# EAGLE design fat_pannal (EAGLE 6.1)
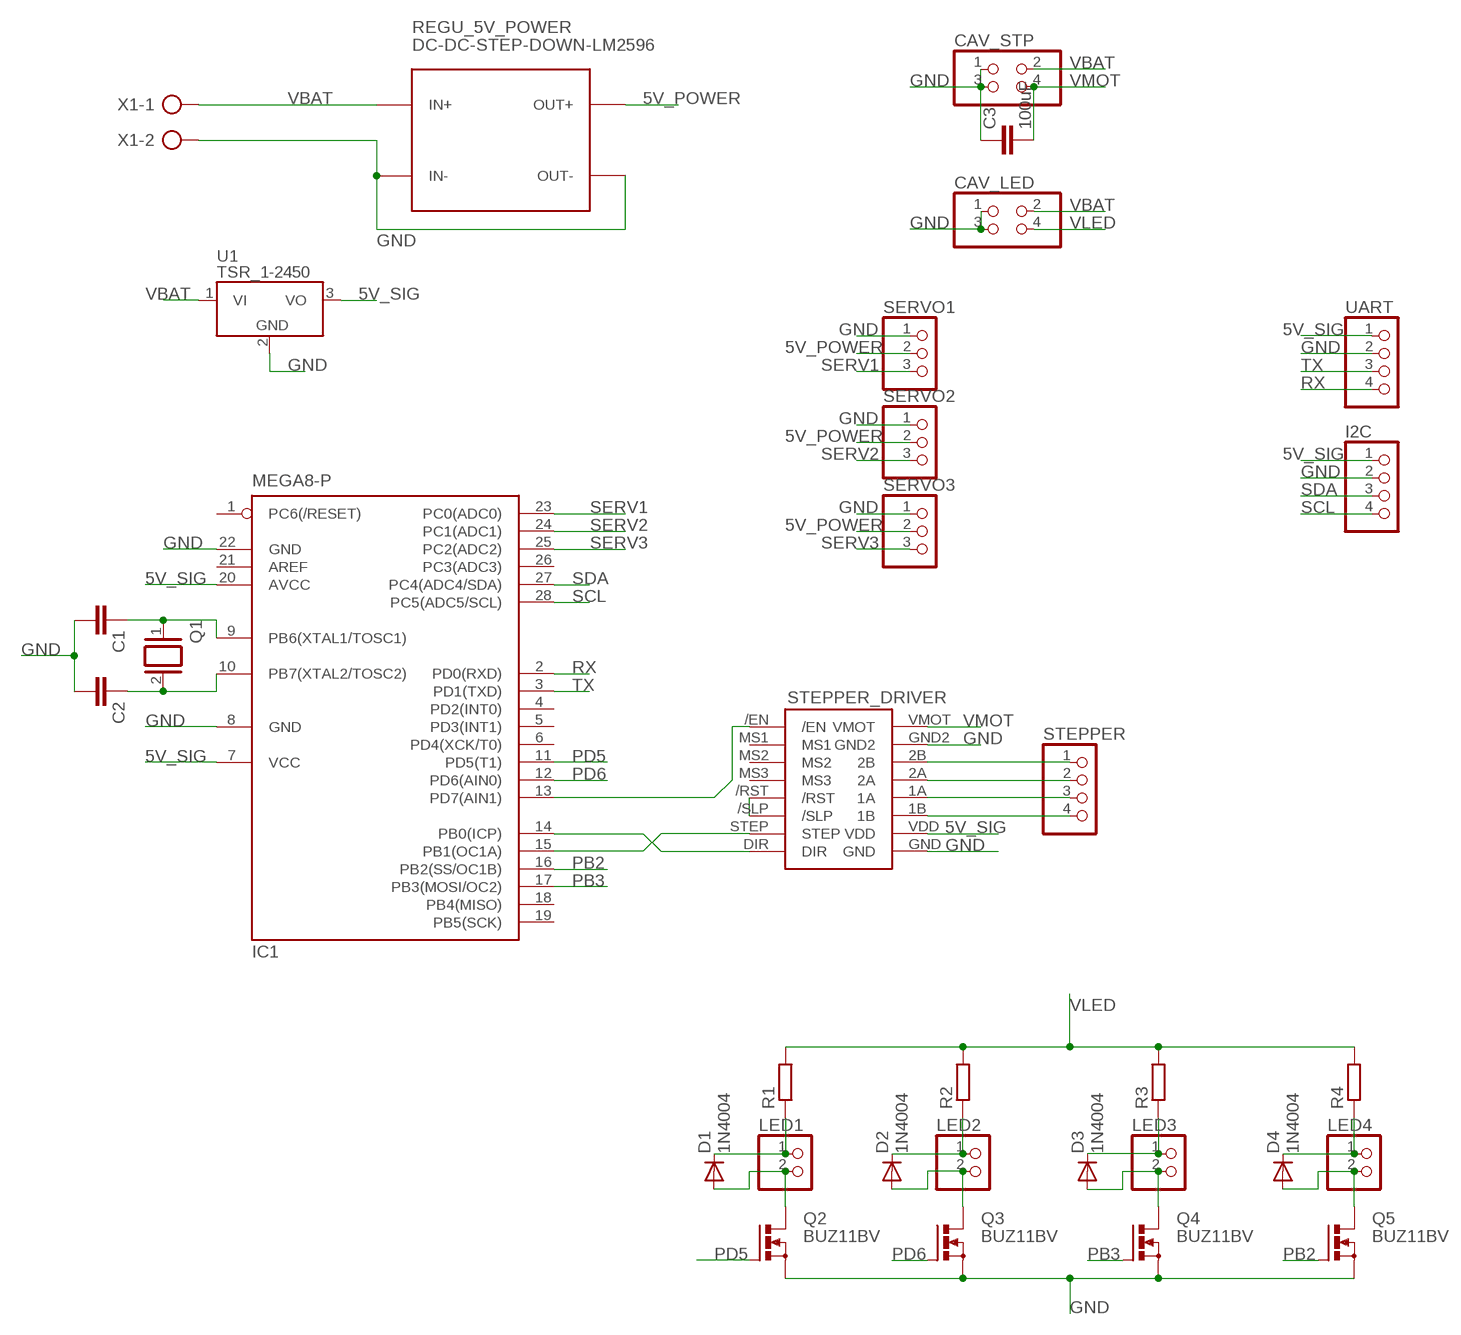
[diagram p0: schematic, sheet 1]

## Parts
C1  C-EU025-030X050  [C025-030X050]
C2  C-EU025-030X050  [C025-030X050]
C3  100uF  C-EU025-050X050  [C025-050X050]
CAV_LED  PINHD-2X2  [2X02]
CAV_STP  PINHD-2X2  [2X02]
D1  1N4004  [DO41-10]
D2  1N4004  [DO41-10]
D3  1N4004  [DO41-10]
D4  1N4004  [DO41-10]
I2C  PINHD-1X4  [1X04]
IC1  MEGA8-P  [DIL28-3]
LED1  PINHD-1X2  [1X02]
LED2  PINHD-1X2  [1X02]
LED3  PINHD-1X2  [1X02]
LED4  PINHD-1X2  [1X02]
Q1  XTAL/S  [QS]
Q2  BUZ11BV  [TO220BV]
Q3  BUZ11BV  [TO220BV]
Q4  BUZ11BV  [TO220BV]
Q5  BUZ11BV  [TO220BV]
R1  R-EU_0309/12  [0309/12]
R2  R-EU_0309/12  [0309/12]
R3  R-EU_0309/12  [0309/12]
R4  R-EU_0309/12  [0309/12]
REGU_5V_POWER  DC-DC-STEP-DOWN-LM2596  [DC-DC-STEP-DOWN-LM2596]
SERVO1  PINHD-1X3  [1X03]
SERVO2  PINHD-1X3  [1X03]
SERVO3  PINHD-1X3  [1X03]
STEPPER  PINHD-1X4  [1X04]
STEPPER_DRIVER  A4988_CARRIER  [A4988_CARRIER]
U1  TSR_1-2450  [TSR-1]
UART  PINHD-1X4  [1X04]
X1  AK300/2  [AK300/2]

## Nets
5V_POWER: REGU_5V_POWER.OUT+ SERVO1.2 SERVO2.2 SERVO3.2
5V_SIG: I2C.1 IC1.7(VCC) IC1.20(AVCC) STEPPER_DRIVER.VDD U1.3(VO) UART.1
GND: C1.2 C2.2 C3.1 CAV_LED.1 CAV_LED.3 CAV_STP.1 CAV_STP.3 I2C.2 IC1.8(GND) IC1.22(GND) Q2.S Q3.S Q4.S Q5.S REGU_5V_POWER.IN- REGU_5V_POWER.OUT- SERVO1.1 SERVO2.1 SERVO3.1 STEPPER_DRIVER.GND STEPPER_DRIVER.GND2 U1.2(GND) UART.2 X1.2
N$1: C1.1 IC1.9(PB6(XTAL1/TOSC1)) Q1.1
N$2: IC1.15(PB1(OC1A)) STEPPER_DRIVER.STEP
N$3: C2.1 IC1.10(PB7(XTAL2/TOSC2)) Q1.2
N$6: IC1.14(PB0(ICP)) STEPPER_DRIVER.DIR
N$9: STEPPER_DRIVER./RST STEPPER_DRIVER./SLP
N$10: IC1.13(PD7(AIN1)) STEPPER_DRIVER./EN
N$11: STEPPER.4 STEPPER_DRIVER.1B
N$12: STEPPER.3 STEPPER_DRIVER.1A
N$13: STEPPER.2 STEPPER_DRIVER.2A
N$14: STEPPER.1 STEPPER_DRIVER.2B
N$19: D1.C LED1.1 R1.1
N$20: D2.C LED2.1 R2.1
N$23: D3.C LED3.1 R3.1
N$24: D4.C LED4.1 R4.1
N$26: D1.A LED1.2 Q2.D
N$27: D2.A LED2.2 Q3.D
N$28: D3.A LED3.2 Q4.D
N$29: D4.A LED4.2 Q5.D
PB2: IC1.16(PB2(SS/OC1B)) Q5.G
PB3: IC1.17(PB3(MOSI/OC2)) Q4.G
PD5: IC1.11(PD5(T1)) Q2.G
PD6: IC1.12(PD6(AIN0)) Q3.G
RX: IC1.2(PD0(RXD)) UART.4
SCL: I2C.4 IC1.28(PC5(ADC5/SCL))
SDA: I2C.3 IC1.27(PC4(ADC4/SDA))
SERV1: IC1.23(PC0(ADC0)) SERVO1.3
SERV2: IC1.24(PC1(ADC1)) SERVO2.3
SERV3: IC1.25(PC2(ADC2)) SERVO3.3
TX: IC1.3(PD1(TXD)) UART.3
VBAT: CAV_LED.2 CAV_STP.2 REGU_5V_POWER.IN+ U1.1(VI) X1.1
VLED: CAV_LED.4 R1.2 R2.2 R3.2 R4.2
VMOT: C3.2 CAV_STP.4 STEPPER_DRIVER.VMOT
Unconnected: IC1.1(PC6(/RESET)) IC1.4(PD2(INT0)) IC1.5(PD3(INT1)) IC1.6(PD4(XCK/T0)) IC1.18(PB4(MISO)) IC1.19(PB5(SCK)) IC1.21(AREF) IC1.26(PC3(ADC3)) STEPPER_DRIVER.MS1 STEPPER_DRIVER.MS2 STEPPER_DRIVER.MS3

## Library data of the parts
C1-C3 = rcl:C-EU: CAPACITOR, European symbol
CAV_LED CAV_STP = pinhead:PINHD-2X2: PIN HEADER
D1-D4 = diode:1N4004: DIODE general purpose rectifier, 1 A
I2C STEPPER UART = pinhead:PINHD-1X4: PIN HEADER
IC1 = atmel:MEGA8-P: MICROCONTROLLER 8 Kbytes FLASH, 1 kbytes SRAM, 512 bytes EEPROM, USART, 4-channel 10 bit ADC, 2-channel 8 bit ADC Pin compatible with Atmega48, ATMega88, ATMega168 Source: avr.lbr; OC_FARNELL: unknown; OC_NEWARK: unknown
LED1-LED4 = pinhead:PINHD-1X2: PIN HEADER
Q1 = special:XTAL/S: CRYSTAL
Q2-Q5 = transistor-power:BUZ11: N-CHANNEL MOS FET
R1-R4 = rcl:R-EU_: RESISTOR, European symbol
REGU_5V_POWER = diy-modules:DC-DC-STEP-DOWN-LM2596: DC/DC Step-Down Regulator based on LM2596-ADJ chip LM2596 datasheet available here: http://www.ti.com/lit/ds/symlink/lm2596.pdf Click here to find device on ebay.com <http://www.ebay.com/sch/lm2596+power+regulator>
SERVO1-SERVO3 = pinhead:PINHD-1X3: PIN HEADER
STEPPER_DRIVER = pololu_stepper_driver:A4988_CARRIER
U1 = _traco_tsr-1:TSR_1-*: TRACO TSR-1 Series Point-of-Load DC/DC-Converters Vi max. 36 V; Vo = (1.2 .. 15)V ±2%; Io = 0 .. 1 A SIP-Package (drop-in replacement for 78xx linear voltage regulators in TO220-package, vertically assembled) Source: www.tracopower.com Technologies: TSR 1- Vi (V) Vo (V) ±2% Io = 0 .. 1 A 24_ ( generic ) 2412 4.6 .. 36 1.2 2415 4.6 .. 36 1.5 2418 4.6 .. 36 1.8 2425 4.6 .. 36 2.5 2433 4.75.. 36 3.3 2450 6.5 .. 36 5.0 2465 9.0 .. 36 6.5 2490 12 .. 36 9.0 24120 15 .. 36 12 24150 18 .. 36 15 Author: Dipl.-Ing. FH Rainer Bayer HHN Hochschule Heilbronn, rainer.bayer@hs-heilbronn.de Ingenieurbüro ing-rb, mail@ing-rb.de
X1 = con-ptr500:AK300/2: CONNECTOR; OC_FARNELL: unknown; OC_NEWARK: unknown

## Board
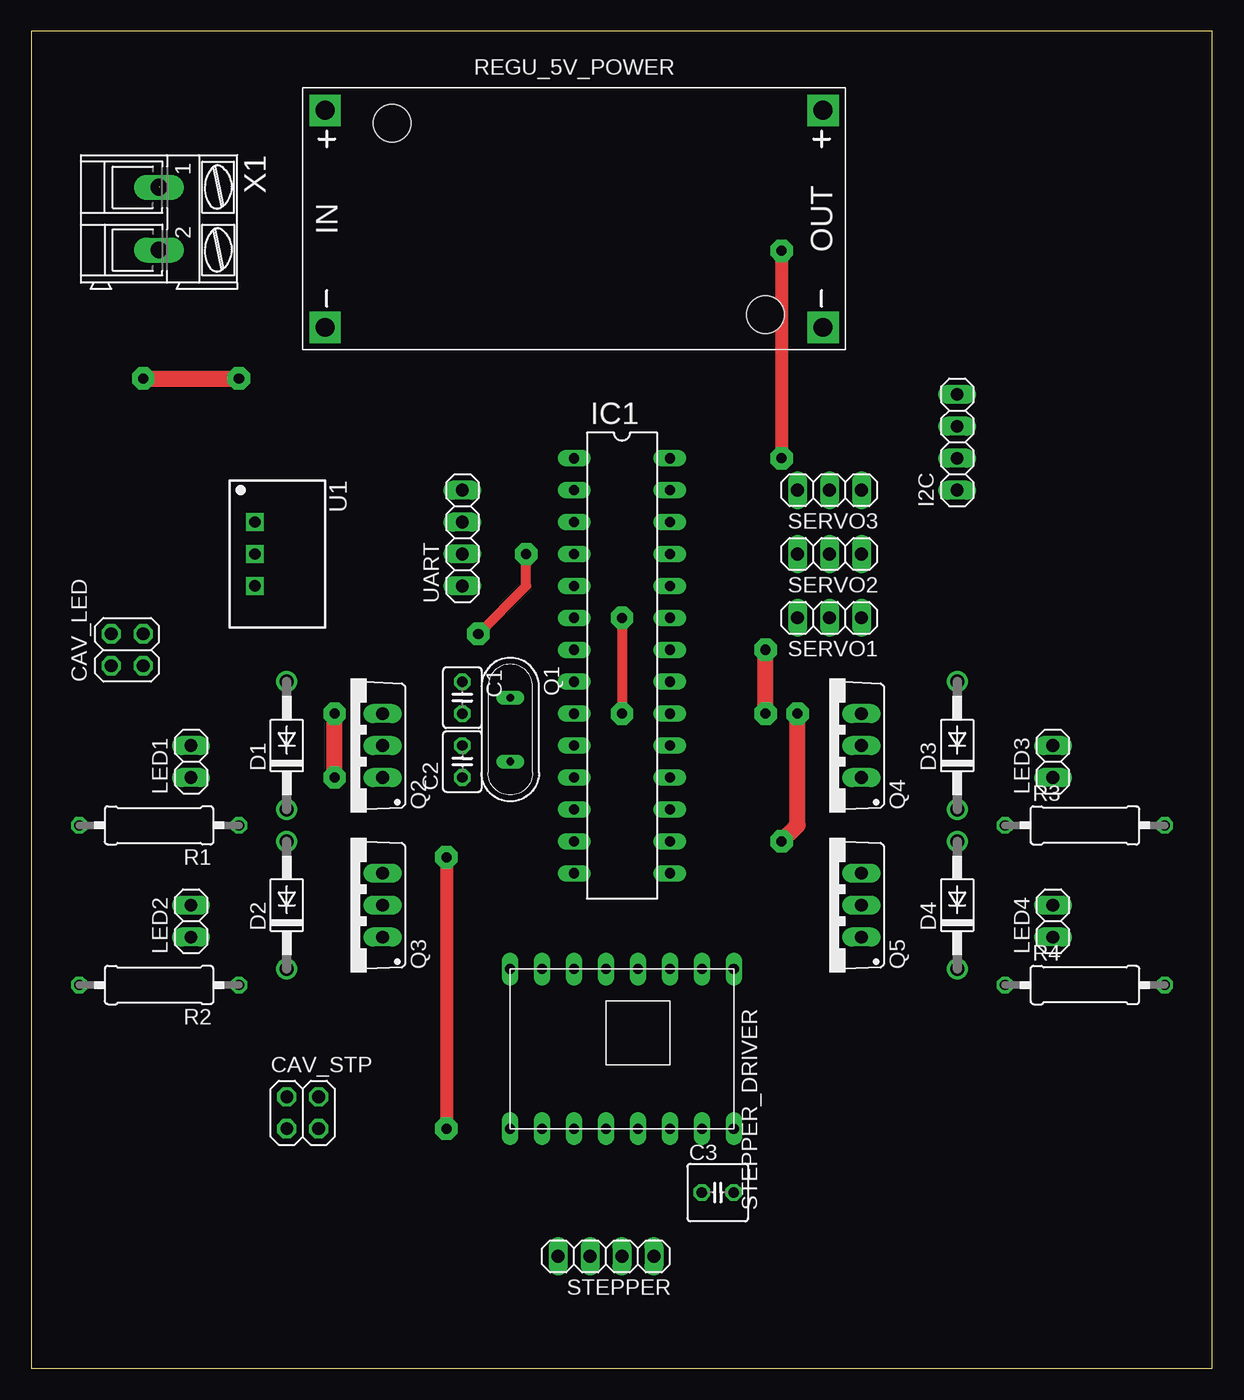
[diagram p1: board, top side]
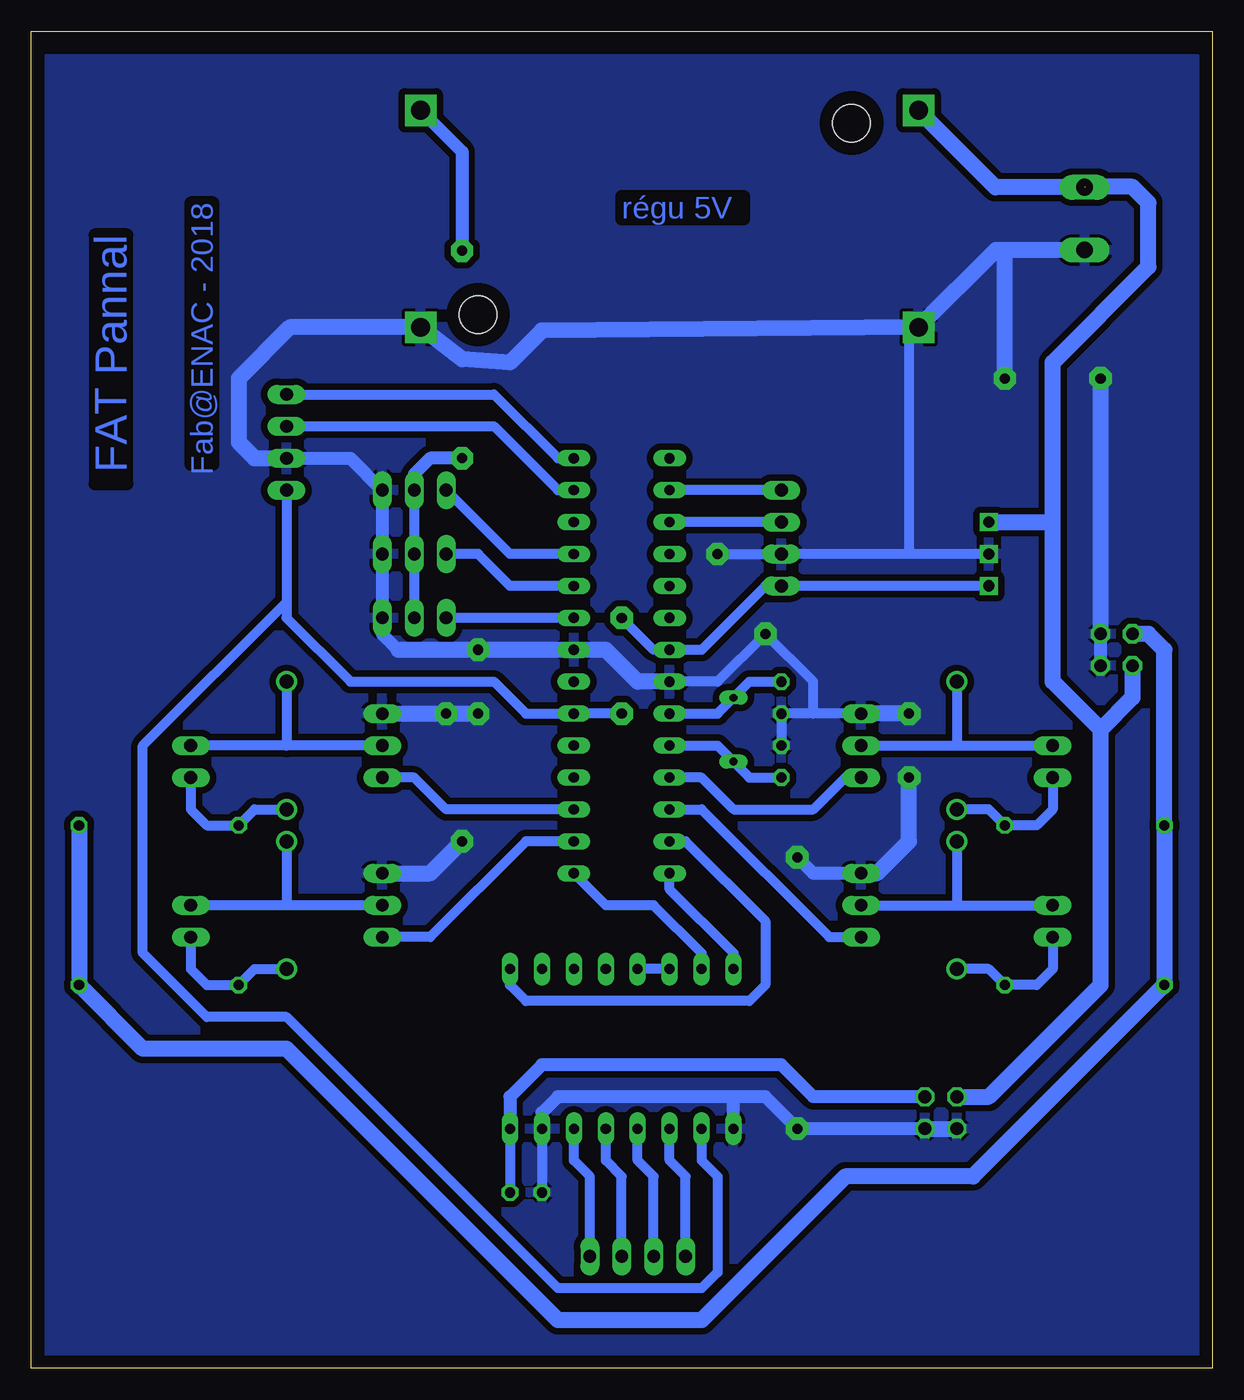
[diagram p2: board, bottom side, seen from below]

Size 93.96 x 106.35 mm. Coordinates in mm from the lower left corner, seen from the top.
Outline: 0,0 93.96,0 93.96,106.35 0,106.35 0,0
Copper layers (1*16): Top 0.035mm / dielectric 1.5mm / Bottom 0.035mm
Design rules: minimum track width 10mil, minimum drill 24mil, track to track 20mil, track to pad 20mil, pad to pad 8mil, via to via 8mil, smd to smd 8mil, copper to edge 40mil, drill to drill 8mil, minimum pad ring 10mil, minimum via ring 8mil, stop-mask expansion 4mil, vias tented up to drill 0mil, thermal gap 10mil

### Footprints (pad centres in the part's own frame; a part is rotated, then mirrored left to right if it is on the bottom)
C025-030X050 = drill 0.813 octagon: 1 -1.27,0; 2 1.27,0
C025-050X050 = drill 0.813 octagon: 1 -1.27,0; 2 1.27,0
2X02 = drill 1.016 octagon: 1 -1.27,-1.27; 2 -1.27,1.27; 3 1.27,-1.27; 4 1.27,1.27
DO41-10 = drill 1.118: A 5.08,0; C -5.08,0
1X04 = drill 1.016 long: 1 -3.81,0; 2 -1.27,0; 3 1.27,0; 4 3.81,0
DIL28-3 = drill 0.813 long: 1 -16.51,-3.81; 2 -13.97,-3.81; 3 -11.43,-3.81; 4 -8.89,-3.81; 5 -6.35,-3.81; 6 -3.81,-3.81; 7 -1.27,-3.81; 8 1.27,-3.81; 9 3.81,-3.81; 10 6.35,-3.81; 11 8.89,-3.81; 12 11.43,-3.81; 13 13.97,-3.81; 14 16.51,-3.81; 15 16.51,3.81; 16 13.97,3.81; 17 11.43,3.81; 18 8.89,3.81; 19 6.35,3.81; 20 3.81,3.81; 21 1.27,3.81; 22 -1.27,3.81; 23 -3.81,3.81; 24 -6.35,3.81; 25 -8.89,3.81; 26 -11.43,3.81; 27 -13.97,3.81; 28 -16.51,3.81
1X02 = drill 1.016 long: 1 -1.27,0; 2 1.27,0
QS = drill 0.61 long: 1 -2.54,0; 2 2.54,0
TO220BV = drill 1.016 long: D 0,-2.54; G -2.54,-2.54; S 2.54,-2.54
0309/12 = drill 0.813 octagon: 1 -6.35,0; 2 6.35,0
DC-DC-STEP-DOWN-LM2596 = drill 1.5 pad 2.5 square: IN+ -19.812,8.636; IN- -19.812,-8.636; OUT+ 19.812,8.636; OUT- 19.812,-8.636 | hole 3: -14.478,7.62; 15.24,-7.62
1X03 = drill 1.016 long: 1 -2.54,0; 2 0,0; 3 2.54,0
A4988_CARRIER = drill 0.8 long: 1A 5.08,-2.54; 1B 5.08,-5.08; 2A 5.08,0; 2B 5.08,2.54; /EN -7.62,7.62; /RST -7.62,-2.54; /SLP -7.62,-5.08; DIR -7.62,-10.16; GND 5.08,-10.16; GND2 5.08,5.08; MS1 -7.62,5.08; MS2 -7.62,2.54; MS3 -7.62,0; STEP -7.62,-7.62; VDD 5.08,-7.62; VMOT 5.08,7.62
TSR-1 = drill 0.9 square: 1 -2.54,0; 2 0,0; 3 2.54,0
AK300/2 = drill 1.321 long: 1 -2.515,0; 2 2.489,0

### Placement (x,y rotation side)
C1  34.29,53.34 270 top
C2  34.29,48.26 90 top
C3  54.61,13.97 0 top
CAV_LED  7.62,57.15 90 top
CAV_STP  21.59,20.32 0 top
D1  20.32,49.53 90 top
D2  20.32,36.83 90 top
D3  73.66,49.53 90 top
D4  73.66,36.83 90 top
I2C  73.66,73.66 90 top
IC1  46.99,55.88 270 top
LED1  12.7,48.26 90 top
LED2  12.7,35.56 90 top
LED3  81.28,48.26 90 top
LED4  81.28,35.56 90 top
Q1  38.1,50.8 270 top
Q2  25.4,49.53 90 top
Q3  25.4,36.83 90 top
Q4  63.5,49.53 90 top
Q5  63.5,36.83 90 top
R1  10.16,43.18 180 top
R2  10.16,30.48 180 top
R3  83.82,43.18 0 top
R4  83.82,30.48 0 top
REGU_5V_POWER  43.18,91.44 0 top
SERVO1  63.5,59.69 180 top
SERVO2  63.5,64.77 180 top
SERVO3  63.5,69.85 180 top
STEPPER  45.72,8.89 180 top
STEPPER_DRIVER  48.26,24.13 270 top
U1  17.78,64.77 270 top
UART  34.29,66.04 90 top
X1  10.16,91.44 270 top

### Tracks (layer width: path | path; a pad name or v marks a point on that pad's centre or on a via)
5V_POWER  (via drill 0.8 pad 1.78)
  Top 1.016: v59.69,88.9 v59.69,72.39
  Bottom 0.813: SERVO3.2 SERVO2.2 SERVO1.2
  Bottom 1.016: REGU_5V_POWER.OUT+ 59.69,96.77 v59.69,88.9 | v59.69,72.39 62.23,72.39 63.5,71.12 SERVO3.2
5V_SIG  (via drill 0.8 pad 1.78)
  Top 0.813: v46.99,59.69 v46.99,52.07
  Bottom 0.813: U1.3 UART.1 35.56,62.23 40.64,57.15 IC1.7 44.45,57.15 v46.99,59.69 | I2C.1 73.66,60.96 | 73.66,60.96 73.66,59.69 68.58,54.61 57.15,54.61 54.61,52.07 IC1.20 v46.99,52.07 | STEPPER_DRIVER.VDD 40.64,16.51 39.37,15.24 39.37,7.62 40.64,6.35 52.07,6.35 73.66,27.94 80.01,27.94 85.09,33.02 85.09,49.53 73.66,60.96
GND  (via drill 0.8 pad 1.78)
  Top 0.813: v35.56,58.42 39.37,62.23 v39.37,64.77
  Top 1.016: v33.02,40.64 v33.02,19.05
  Top 1.27: v8.89,78.74 v16.51,78.74 | v24.13,46.99 v24.13,52.07 | v58.42,52.07 v58.42,57.15 | v59.69,41.91 60.96,43.18 v60.96,52.07
  Bottom 0.813: C2.2 C1.2 31.75,52.07 | STEPPER_DRIVER.GND2 C3.1 | U1.2 24.13,64.77 | 24.13,64.77 UART.2 v39.37,64.77 | REGU_5V_POWER.IN- 23.88,82.8 24.13,82.55 24.13,64.77 | Q2.S 31.75,52.07 | 31.75,52.07 31.75,54.61 v35.56,58.42 39.37,54.61 IC1.8
  Bottom 1.016: 64.77,57.15 66.04,58.42 SERVO1.1 SERVO2.1 SERVO3.1 68.58,72.39 I2C.2 | CAV_LED.1 CAV_LED.3 | CAV_STP.3 v33.02,19.05 35.56,21.59 38.1,21.59 | 38.1,21.59 52.07,21.59 53.34,20.32 STEPPER_DRIVER.GND2 | STEPPER_DRIVER.GND 38.1,21.59 | Q3.S 31.75,39.37 v33.02,40.64
  Bottom 1.27: X1.2 16.51,88.95 | 16.51,88.95 17.22,88.95 REGU_5V_POWER.IN- 53.34,82.55 55.88,80.01 59.69,80.26 REGU_5V_POWER.OUT- 63.25,82.8 | CAV_STP.3 CAV_STP.1 | I2C.2 76.2,72.39 77.47,73.66 77.47,78.74 73.41,82.8 63.25,82.8 | CAV_LED.3 v8.89,78.74 | v16.51,78.74 16.51,88.95 | Q3.S 26.67,39.37 24.13,41.91 v24.13,46.99 | v24.13,52.07 Q2.S | 63.25,82.8 63.5,82.55 | Q4.S v60.96,52.07 v58.42,52.07 | 64.77,57.15 v58.42,57.15 IC1.22 48.26,57.15 45.72,54.61 IC1.8 | Q5.S 62.23,39.37 v59.69,41.91
  pour Bottom: 1.27,1.27 1.27,104.14 92.71,104.14 92.71,1.27
N$1
  Bottom 0.813: IC1.9 39.37,52.07 Q1.1 36.83,54.61 C1.1
N$2
  Bottom 0.813: STEPPER_DRIVER.STEP 40.64,33.02 44.45,36.83 48.26,36.83 IC1.15
N$3
  Bottom 0.813: IC1.10 39.37,49.53 Q1.2 36.83,46.99 C2.1
N$6
  Bottom 0.813: STEPPER_DRIVER.DIR 38.1,33.02 43.18,38.1 IC1.14
N$9
  Bottom 0.813: STEPPER_DRIVER./SLP STEPPER_DRIVER./RST
N$10
  Bottom 0.813: IC1.13 41.91,41.91 35.56,35.56 35.56,30.48 36.83,29.21 54.61,29.21 55.88,30.48 STEPPER_DRIVER./EN
N$11
  Bottom 0.813: STEPPER.4 41.91,15.24 43.18,16.51 STEPPER_DRIVER.1B
N$12
  Bottom 0.813: STEPPER.3 44.45,15.24 45.72,16.51 STEPPER_DRIVER.1A
N$13
  Bottom 0.813: STEPPER.2 46.99,15.24 48.26,16.51 STEPPER_DRIVER.2A
N$14
  Bottom 0.813: STEPPER.1 49.53,15.24 50.8,16.51 STEPPER_DRIVER.2B
N$19
  Bottom 0.813: LED1.1 12.7,44.45 13.97,43.18 R1.1 17.78,44.45 D1.C
N$20
  Bottom 0.813: LED2.1 12.7,31.75 13.97,30.48 R2.1 17.78,31.75 D2.C
N$23
  Bottom 0.813: LED3.1 81.28,44.45 80.01,43.18 R3.1 76.2,44.45 D3.C
N$24
  Bottom 0.813: LED4.1 81.28,31.75 80.01,30.48 R4.1 76.2,31.75 D4.C
N$26
  Bottom 0.813: Q2.D 20.32,49.53 | 20.32,49.53 LED1.2 | D1.A 20.32,49.53
N$27
  Bottom 0.813: Q3.D 20.32,36.83 | 20.32,36.83 LED2.2 | D2.A 20.32,36.83
N$28
  Bottom 0.813: Q4.D 73.66,49.53 | 73.66,49.53 LED3.2 | D3.A 73.66,49.53
N$29
  Bottom 0.813: Q5.D 73.66,36.83 | 73.66,36.83 LED4.2 | D4.A 73.66,36.83
PB2
  Bottom 0.813: IC1.16 54.61,41.91 62.23,34.29 Q5.G
PB3
  Bottom 0.813: IC1.17 60.96,44.45 63.5,46.99 Q4.G
PD5
  Bottom 0.813: IC1.11 40.64,46.99 38.1,44.45 31.75,44.45 29.21,46.99 Q2.G
PD6
  Bottom 0.813: IC1.12 40.64,44.45 30.48,34.29 Q3.G
RX
  Bottom 0.813: UART.4 IC1.2
SCL
  Bottom 0.813: I2C.4 57.15,77.47 52.07,72.39 IC1.28
SDA
  Bottom 0.813: I2C.3 57.15,74.93 52.07,69.85 IC1.27
SERV1
  Bottom 0.813: IC1.23 SERVO1.3
SERV2
  Bottom 0.813: IC1.24 55.88,62.23 58.42,64.77 SERVO2.3
SERV3
  Bottom 0.813: IC1.25 55.88,64.77 SERVO3.3
TX
  Bottom 0.813: UART.3 IC1.3
VBAT  (1 unrouted)
  Bottom 1.27: X1.1 17.25,93.95 REGU_5V_POWER.IN+ | CAV_STP.2 17.78,21.59 8.89,30.48 8.89,50.8 | 8.89,50.8 12.7,54.61 12.7,67.31 | 12.7,67.31 12.7,80.01 5.08,87.63 5.08,92.71 6.35,93.98 10.16,93.98 | U1.1 12.7,67.31 | CAV_LED.2 6.35,53.34 8.89,50.8
VLED
  Bottom 1.27: R3.2 R4.2 85.09,25.4 73.66,25.4 52.07,3.81 40.64,3.81 29.21,15.24 19.05,15.24 R2.2 R1.2 3.81,57.15 5.08,58.42 CAV_LED.4
VMOT
  Bottom 0.813: STEPPER_DRIVER.VMOT C3.2
  Bottom 1.016: CAV_STP.4 31.75,21.59 34.29,24.13 53.34,24.13 55.88,21.59 STEPPER_DRIVER.VMOT

### Text on the board
Bottom: Fab@ENAC - 2018 | régu 5V | FAT Pannal